# Altium schematic sheet Local_Power_5V_Rev1.1.SchDoc
size A4
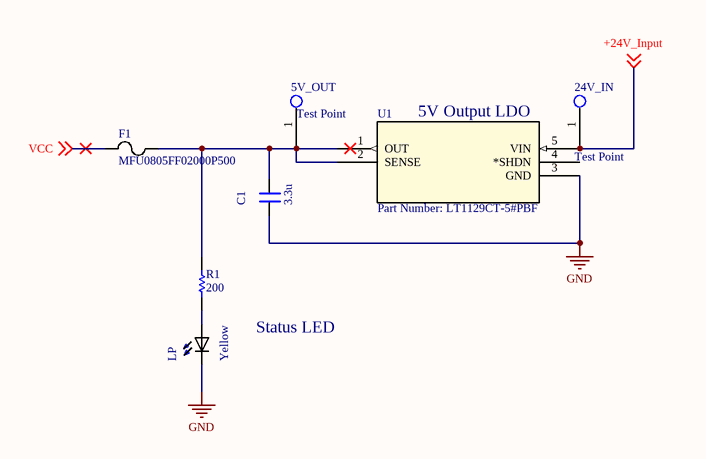
[diagram p0: Local_Power_5V_Rev1.1.SchDoc]

## Parts
5V_OUT  Test Point  [Test Point Through-hole]
24V_IN  Test Point  [Test Point Through-hole]
C1  3.3u  [*CAPC2012X88N]
F1  MFU0805FF02000P500  [FUS_VISHAY_MFU08]
LP  Yellow  [*DIOC200X125X110_LTST-C171KSKT(Primary)]
R1  200  [RESC0805(2012)_M]
U1  Part Number: LT1129CT-5#PBF  [TO220-5_T]

## Nets
GND: C1.1 LP.NEG U1.3(GND)
+24V_Input: 24V_IN.1 U1.5(VIN) ; off-sheet +24V_Input
VCC: F1.1 ; off-sheet VCC
Net5V_OUT_1: 5V_OUT.1 C1.2 F1.2 R1.2 U1.1(OUT) U1.2(SENSE)
NetLP_POS: LP.POS R1.1

Not connected (* = marked no-connect by the designer): U1 4(*SHDN)

## Notes on the sheet
- (near U1) 5V Output LDO
- Status LED
- Title
- Size:
- Date:
- A4
- Number:
- Time:
- Revision:
- Sheet
- of
- File:

## Library data of the parts
C1 = C0805C101JAGAC7800: / 100pF Â±5% 250V Ceramic Capacitor C0G, NP0 0805 _2012 Metric_ /; MF: KEMET; Package: 0805 KEMET; Digi-Key_Part_Number: 399-15000-1-ND; MP: C0805C101JAGAC7800; Digi-Key_Purchase_URL: https://www.digikey.com/product-detail/en/kemet/C0805C101JAGAC7800/399-15000-1-ND/7382549?utm_source=snapeda&utm_medium=aggregator&utm_campaign=symbol; SnapEDA_Link: https://www.snapeda.com/parts/C0805C101JAGAC7800/KEMET/view-part/3661430/?ref=snap; Value: *
F1 = MFU0805FF02000P5: No Description Available; Vendor: VISHAY; Built_By: EMA_UL_Team; Type: DEV; Manufacturer_Part_Number: MFU0805FF02000P500; Copyright: Copyright (C) 2018 Accelerated Designs. All rights reserved; RefDes: RefDes; Value: Value
LP = LTST-C171KSKT: / Yellow 2 x 1.25 x 0.8 mm 130Â° Water Clear 50 mcd 2 V LED SMT /; MF: Lite-On Inc.; SnapEDA_Link: https://www.snapeda.com/parts/LTST-C171KSKT/Lite-On%20Inc./view-part/?ref=snap; Package: 0805 Lite-On; MP: LTST-C171KSKT; Digi-Key_Part_Number: 160-1428-1-ND; Digi-Key_Purchase_URL: https://www.digikey.com/product-detail/en/lite-on-inc/LTST-C171KSKT/160-1428-1-ND/386802?utm_source=snapeda&utm_medium=aggregator&utm_campaign=symbol; Value: *
R1 = CMP-1013-00951-1: 8M06 0.125W 1% 0805 (2012 Metric)  SMD; Value: 8060000.00 Ohm; Case-EIA: 0805; Case-Metric: 2012; Power: 0.125 W; Technology: SMT; Tolerance: 1 %
U1 = LT1129CT-5#PBF: No Description Available; Vendor: Linear Technology; Built_By: EMA_UL_Team; Manufacturer_Part_Number: LT1129CT-5#PBF; Copyright: Copyright (C) 2018 Accelerated Designs. All rights reserved; RefDes: RefDes; Type: DEV; Value: Value